# Altium project panneau_de_controle_d'acces_pcb.PrjPcb
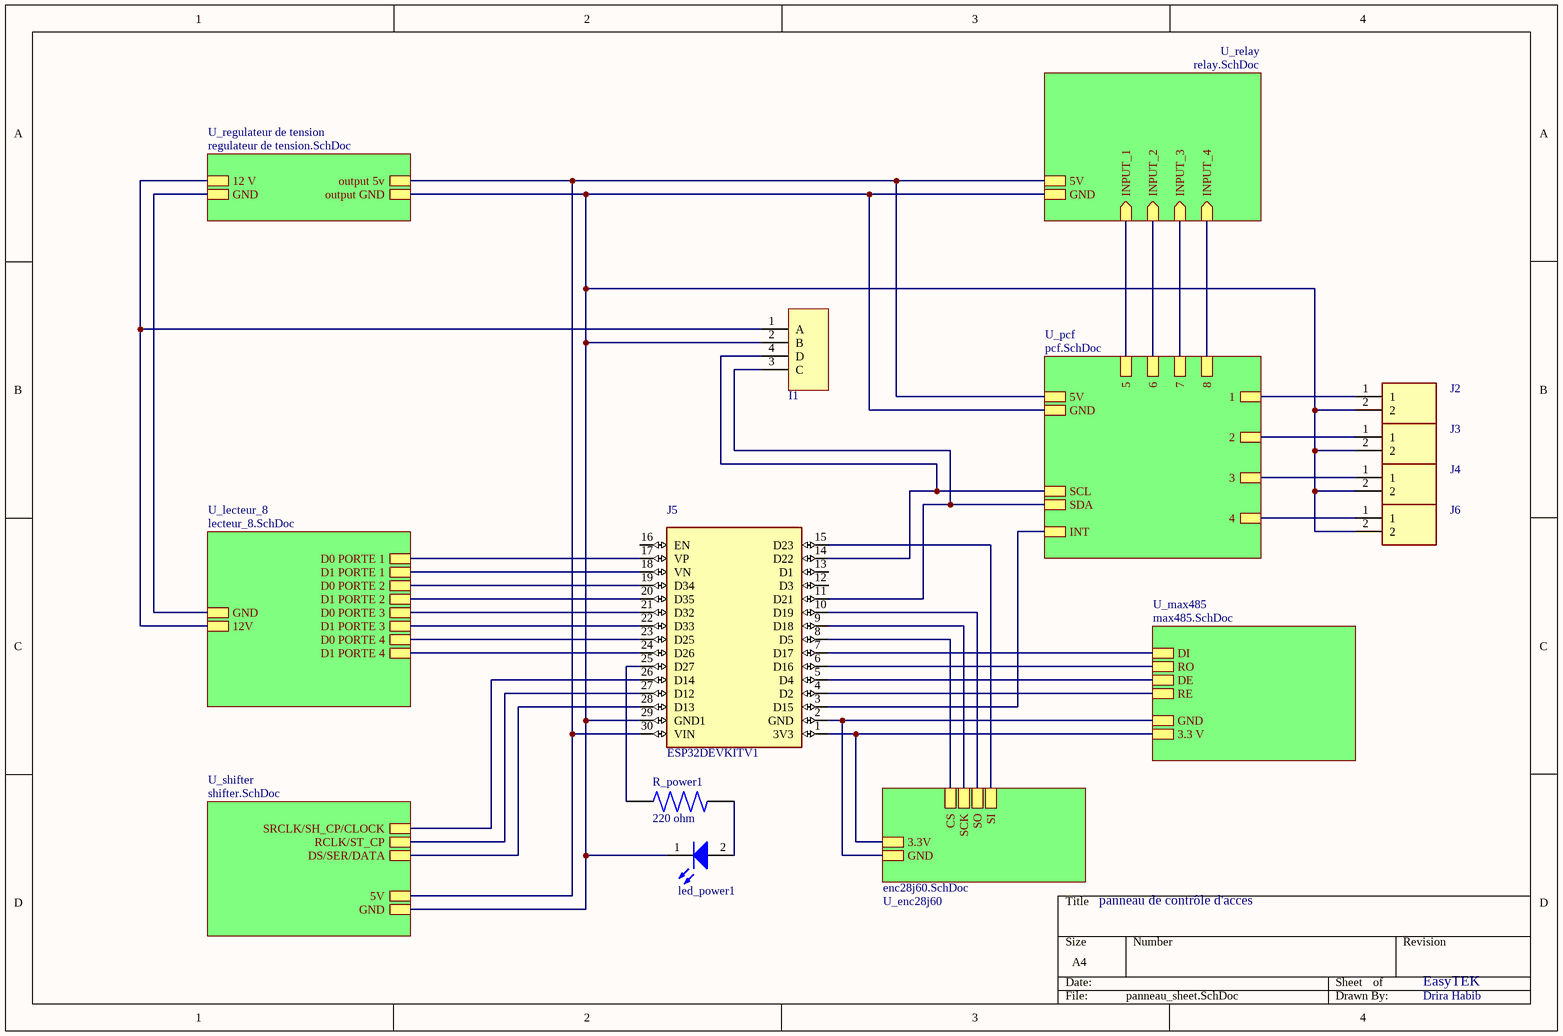
[diagram p0: panneau_sheet.SchDoc]
8 sheets, 79 parts. Net scope: hierarchical (ports join the sheet entries above them; power ports are global).
Board file: panneaucontrol_pcb.PcbDoc
Sheets:
  panneau_sheet.SchDoc
    U_enc28j60 = enc28j60.SchDoc
    U_lecteur_8 = lecteur_8.SchDoc
    U_regulateur de tension = regulateur de tension.SchDoc
    U_max485 = max485.SchDoc
    U_pcf = pcf.SchDoc
    U_relay = relay.SchDoc
    U_shifter = shifter.SchDoc

## Sheet panneau_sheet.SchDoc
size A4

### Parts
I1  Header 4  [JST_4_PIN]  (value not drawn)
J2  1546215-2  [15462152]  (value not drawn)
J3  1546215-2  [15462152]  (value not drawn)
J4  1546215-2  [15462152]  (value not drawn)
J5  ESP32DEVKITV1  [ESP32-DEVKITV1_3D]
J6  1546215-2  [15462152]  (value not drawn)
led_power1  Infrared, 1.5V, 35°  [WL-TIRW_D5.8H8.6]  (value not drawn)
R_power1  value 220 ohm  [RES_ERA2APB221X]  (hidden comment: ERA2APB221X)

### Sub-sheets
U_enc28j60 = enc28j60.SchDoc: 3.3V, CS, SI, GND, SCK, SO
U_lecteur_8 = lecteur_8.SchDoc: D1 PORTE 1, D0 PORTE 1, GND, 12V, D1 PORTE 2, D0 PORTE 2, D1 PORTE 3, D0 PORTE 3, D1 PORTE 4, D0 PORTE 4
U_max485 = max485.SchDoc: DI, DE, RE, RO, 3.3 V, GND
U_pcf = pcf.SchDoc: INT, SDA, GND, SCL, 5V, 1, 2, 3, 4, 5, 6, 7, 8
U_regulateur de tension = regulateur de tension.SchDoc: output 5v, output GND, 12 V, GND
U_relay = relay.SchDoc: INPUT_4 (in), INPUT_3 (in), INPUT_2 (in), GND, INPUT_1 (in), 5V
U_shifter = shifter.SchDoc: SRCLK/SH_CP/CLOCK, DS/SER/DATA, RCLK/ST_CP, GND, 5V

### Nets
5v: J5.30(VIN) ; sheet U_regulateur de tension/output 5v, sheet U_pcf/5V, sheet U_relay/5V, sheet U_shifter/5V
+12: I1.1(A) ; sheet U_lecteur_8/12V, sheet U_regulateur de tension/12 V
GND_1: I1.2(B) J2.2 J3.2 J4.2 J5.29(GND1) J6.2 led_power1.1(K) ; sheet U_lecteur_8/GND, sheet U_regulateur de tension/output GND, sheet U_regulateur de tension/GND, sheet U_pcf/GND, sheet U_relay/GND, sheet U_shifter/GND
NetD2_1: sheet U_pcf/5, sheet U_relay/INPUT_1
NetD3_1: sheet U_pcf/6, sheet U_relay/INPUT_2
NetD4_1: sheet U_pcf/7, sheet U_relay/INPUT_3
NetD5_1: sheet U_pcf/8, sheet U_relay/INPUT_4
NetENC1_3: J5.10(D19) ; sheet U_enc28j60/SO
NetENC1_5: J5.9(D18) ; sheet U_enc28j60/SCK
NetENC1_6: J5.15(D23) ; sheet U_enc28j60/SI
NetENC1_8: J5.8(D5) ; sheet U_enc28j60/CS
NetENC1_9: J5.2(GND) ; sheet U_enc28j60/GND, sheet U_max485/GND
NetENC1_10: J5.1(3V3) ; sheet U_enc28j60/3.3V, sheet U_max485/3.3 V
NetI1_3: I1.3(C) J5.11(D21) ; sheet U_pcf/SDA
NetI1_4: I1.4(D) J5.14(D22) ; sheet U_pcf/SCL
NetJ2_1: J2.1 ; sheet U_pcf/1
NetJ3_1: J3.1 ; sheet U_pcf/2
NetJ4_1: J4.1 ; sheet U_pcf/3
NetJ5_3: J5.3(D15) ; sheet U_pcf/INT
NetJ5_4: J5.4(D2) ; sheet U_max485/RE
NetJ5_5: J5.5(D4) ; sheet U_max485/DE
NetJ5_6: J5.6(D16) ; sheet U_max485/RO
NetJ5_7: J5.7(D17) ; sheet U_max485/DI
NetJ5_17: J5.17(VP) ; sheet U_lecteur_8/D0 PORTE 1
NetJ5_18: J5.18(VN) ; sheet U_lecteur_8/D1 PORTE 1
NetJ5_19: J5.19(D34) ; sheet U_lecteur_8/D0 PORTE 2
NetJ5_20: J5.20(D35) ; sheet U_lecteur_8/D1 PORTE 2
NetJ5_21: J5.21(D32) ; sheet U_lecteur_8/D0 PORTE 3
NetJ5_22: J5.22(D33) ; sheet U_lecteur_8/D1 PORTE 3
NetJ5_23: J5.23(D25) ; sheet U_lecteur_8/D0 PORTE 4
NetJ5_24: J5.24(D26) ; sheet U_lecteur_8/D1 PORTE 4
NetJ5_25: J5.25(D27) R_power1.1
NetJ5_26: J5.26(D14) ; sheet U_shifter/SRCLK/SH_CP/CLOCK
NetJ5_27: J5.27(D12) ; sheet U_shifter/RCLK/ST_CP
NetJ5_28: J5.28(D13) ; sheet U_shifter/DS/SER/DATA
NetJ6_1: J6.1 ; sheet U_pcf/4
Netled_power1_2: led_power1.2(A) R_power1.2

Not connected (* = marked no-connect by the designer): J5 12(D3) 13(D1) 16(EN)

### Notes on the sheet
- panneau de contrôle d'acces
- EasyTEK
- Drira Habib

### Library data of the parts
I1 = Connector_4Pin
J2-J4 J6 = 1546215-2: Connector; Manufacturer_Name: TE Connectivity; Datasheet Link: https://www.te.com/commerce/DocumentDelivery/DDEController?Action=srchrtrv&DocNm=1546215&DocType=Customer+Drawing&DocLang=English; Height: 10.3mm; Manufacturer_Part_Number: 1546215-2; Mouser Part Number: 571-1546215-2; Mouser Price/Stock: https://www.mouser.co.uk/ProductDetail/TE-Connectivity/1546215-2?qs=Lxq28tKK6BPmJFoAOY7Ljw%3D%3D; Arrow Part Number: 1546215-2; Arrow Price/Stock: https://www.arrow.com/en/products/1546215-2/te-connectivity?region=nac
J5 = ESP32DEVKITV1: Dual core, Wi-Fi: 2.4 GHz up to 150 Mbits/s,BLE (Bluetooth Low Energy) and legacy Bluetooth, 32 bits, Up to 240 MHz; MF: Do it; Check_prices: https://www.snapeda.com/parts/ESP32%20DEVKIT%20V1/Do%20it/view-part/5659245/?ref=eda; Value: *; SnapEDA_Link: https://www.snapeda.com/parts/ESP32%20DEVKIT%20V1/Do%20it/view-part/5659245/?ref=snap; Package: Package; Availability: Unavailable; Price: None; MP: ESP32 DEVKIT V1
led_power1 = 15400585A3590: WL-TIRW THT Infrared Round Waterclear, D5.8 x H8.6mm, 85mW/sr, Infrared, 1.5V, 35°; Manufacturer: Wurth Elektronik; Centroid Wavelength: 845nm; Chip Technology: AlGaAs; Peak Wavelength: 850nm; Manufacturer Part Number: 15400585A3590; Category: Infrared LEDs; Match Code: WL-TIRW; ComponentLink1Description: Website Link; ComponentLink1URL: https://www.we-online.com/redexpert/article/15400585A3590?ad; ComponentLink2Description: Datasheet Link; ComponentLink2URL: https://www.we-online.com/redexpert/spec/15400585A3590?ad; Mount: Through Hole; Operating Temperature Max: 85°C; Operating Temperature Min: -40°C; Packaging: Bulk; Height: 8.6mm; Diameter: 5.8mm; Emitting Color: Infrared; Forward Voltage: 1.5V; Radiant Intensity: 85mW/sr; Viewing Angle: 35°
R_power1 = ERA2APB221X: Availability: Unavailable; MP: ERA2APB221X; Price: None; Package: None

## Sheet enc28j60.SchDoc
size A4
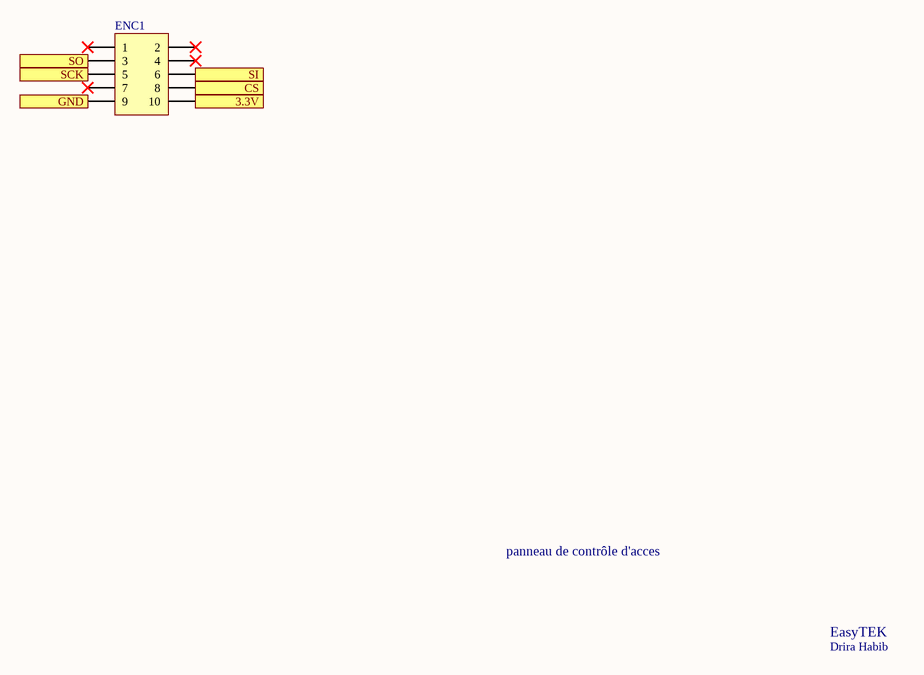
[diagram p1: enc28j60.SchDoc]

### Parts
ENC1  Header 5X2  [HDR2X5]  (value not drawn)

### Ports
3.3V, CS, GND, SCK, SI, SO

### Nets
NetENC1_3: ENC1.3 ; port SO
NetENC1_5: ENC1.5 ; port SCK
NetENC1_6: ENC1.6 ; port SI
NetENC1_8: ENC1.8 ; port CS
NetENC1_9: ENC1.9 ; port GND
NetENC1_10: ENC1.10 ; port 3.3V

Not connected (* = marked no-connect by the designer): ENC1 1* 2* 4* 7*

### Notes on the sheet
- panneau de contrôle d'acces
- EasyTEK
- Drira Habib

### Library data of the parts
ENC1 = Header 5X2: Header, 5-Pin, Dual row; LatestRevisionDate: 17-Jul-2002; LatestRevisionNote: Re-released for DXP Platform.; Publisher: Altium Limited

## Sheet lecteur_8.SchDoc
size A4
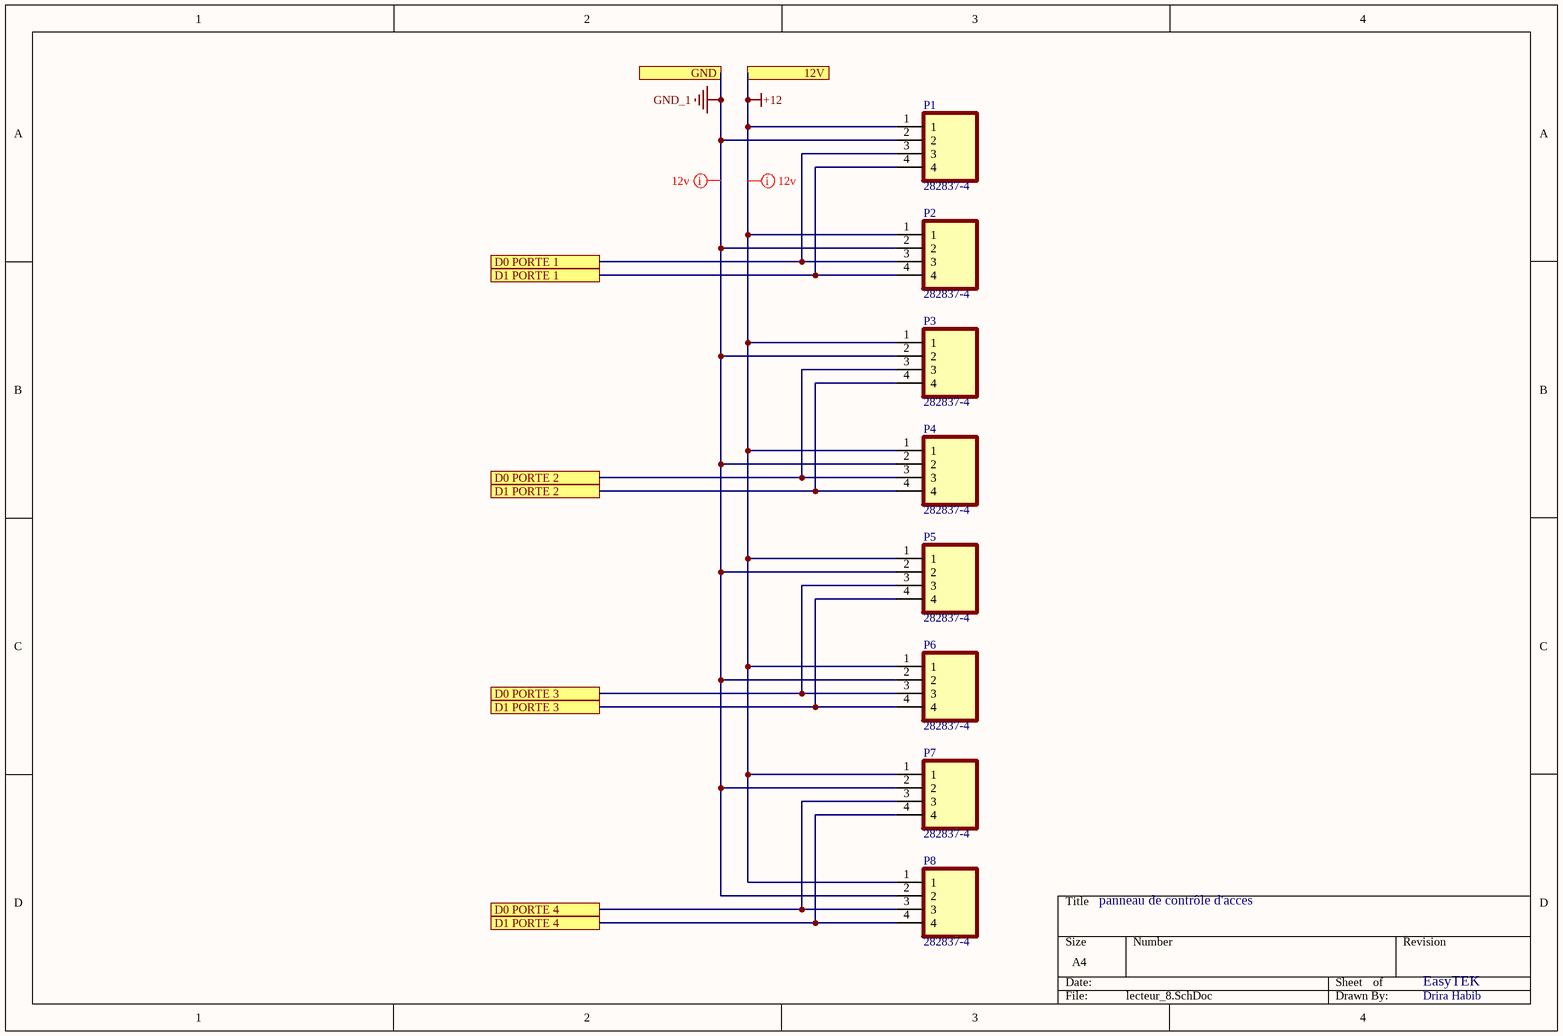
[diagram p2: lecteur_8.SchDoc]

### Parts
P1  282837-4  [TE_282837-4]
P2  282837-4  [TE_282837-4]
P3  282837-4  [TE_282837-4]
P4  282837-4  [TE_282837-4]
P5  282837-4  [TE_282837-4]
P6  282837-4  [TE_282837-4]
P7  282837-4  [TE_282837-4]
P8  282837-4  [TE_282837-4]

### Ports
12V, D0 PORTE 1, D0 PORTE 2, D0 PORTE 3, D0 PORTE 4, D1 PORTE 1, D1 PORTE 2, D1 PORTE 3, D1 PORTE 4, GND

### Nets
+12: P1.1 P2.1 P3.1 P4.1 P5.1 P6.1 P7.1 P8.1 ; port 12V
GND_1: P1.2 P2.2 P3.2 P4.2 P5.2 P6.2 P7.2 P8.2 ; port GND
NetJ5_17: P1.3 P2.3 ; port D0 PORTE 1
NetJ5_18: P1.4 P2.4 ; port D1 PORTE 1
NetJ5_19: P3.3 P4.3 ; port D0 PORTE 2
NetJ5_20: P3.4 P4.4 ; port D1 PORTE 2
NetJ5_21: P5.3 P6.3 ; port D0 PORTE 3
NetJ5_22: P5.4 P6.4 ; port D1 PORTE 3
NetJ5_23: P7.3 P8.3 ; port D0 PORTE 4
NetJ5_24: P7.4 P8.4 ; port D1 PORTE 4

### Layout directives
net class 12: +12, GND_1

### Notes on the sheet
- panneau de contrôle d'acces
- EasyTEK
- Drira Habib

### Library data of the parts
P1-P8 = 282837-4: 4 Position Wire to Board Terminal Block Horizontal with Board 0.200 (5.08mm) Through Hole; MF: TE Connectivity; Value: *; SnapEDA_Link: https://www.snapeda.com/parts/282837-4/TE+Connectivity+AMP+Connectors/view-part/?ref=snap; Purchase-URL: https://pricing.snapeda.com/search/part/282837-4/?ref=eda; EU_RoHS_Compliance: Compliant with Exemptions; Availability: In Stock; Price: None; Package: None; Check_prices: https://www.snapeda.com/parts/282837-4/TE+Connectivity+AMP+Connectors/view-part/?ref=eda; MP: 282837-4

## Sheet regulateur de tension.SchDoc
size A4
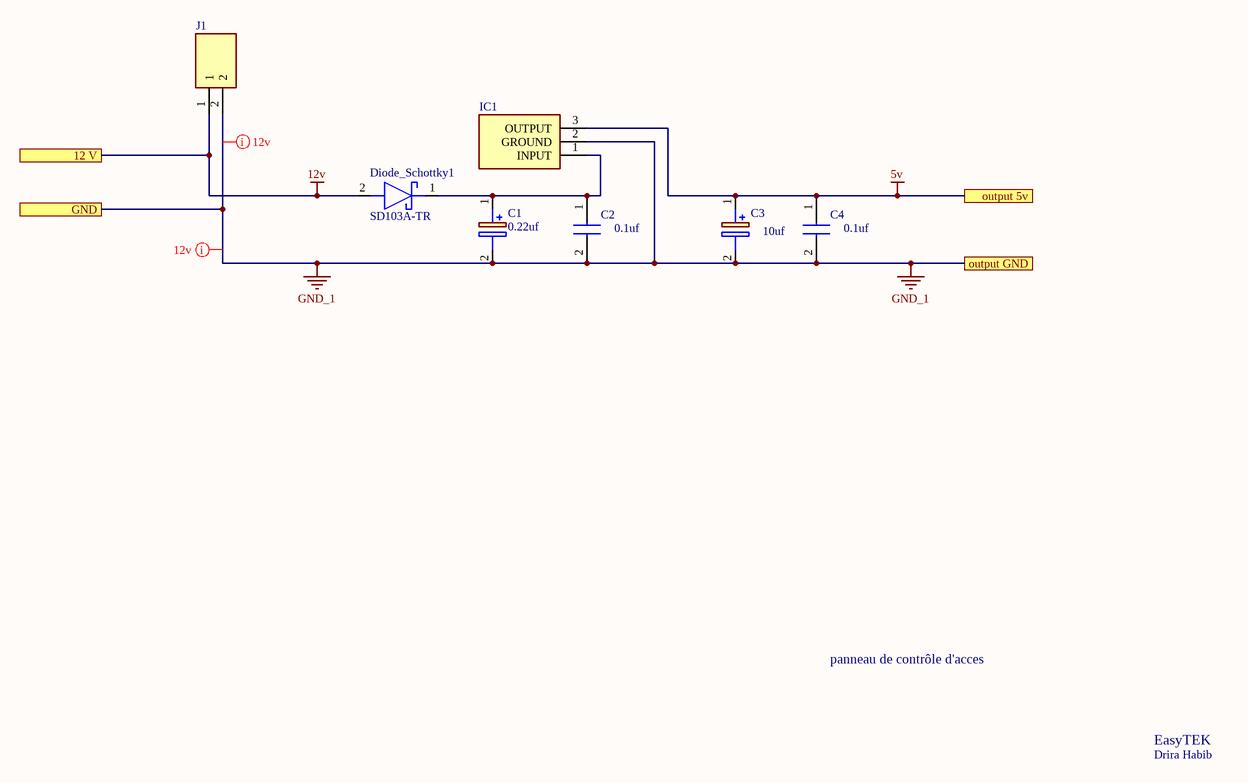
[diagram p3: regulateur de tension.SchDoc]

### Parts
C1  0.22uf  [CAPPRD200W52D500H1250]
C2  0.1uf  [RDE5C1H330J0M1H03A]
C3  10uf  [CAPPRD200W55D500H1250]
C4  0.1uf  [RDE5C1H330J0M1H03A]
Diode_Schottky1  SD103A-TR  [DIOAD950W60L350D150]
IC1  L7805CV  [TO255P460X1020X2008-3P]  (value not drawn)
J1  1546215-2  [15462152]  (value not drawn)

### Ports
12 V, GND, output 5v, output GND

### Nets
5v: C3.1(+) C4.1 IC1.3(OUTPUT) ; port output 5v
12v: Diode_Schottky1.2(A) J1.1 ; port 12 V  [project net +12]
GND_1: C1.2(-) C2.2 C3.2(-) C4.2 IC1.2(GROUND) J1.2 ; port output GND, port GND
NetC1_1: C1.1(+) C2.1 Diode_Schottky1.1(K) IC1.1(INPUT)

### Layout directives
net class 12; net class *: GND_1
net class 12: GND_1

### Notes on the sheet
- panneau de contrôle d'acces
- EasyTEK
- Drira Habib

### Library data of the parts
C1 = 860010772002: Capacitor Polarised; Manufacturer_Name: Wurth Elektronik; Datasheet Link: https://componentsearchengine.com/Datasheets/1/860010772002.pdf; Height: 12.5mm; Manufacturer_Part_Number: 860010772002; Mouser Part Number: 710-860010772002; Mouser Price/Stock: https://www.mouser.co.uk/ProductDetail/Wurth-Elektronik/860010772002?qs=0KOYDY2FL2%2FXueoM4QQtRg%3D%3D
C2 C4 = RDER71E104K0K1H03B: Capacitor; Manufacturer_Name: Murata Electronics; Datasheet Link: https://psearch.en.murata.com/capacitor/product/RDER71E104K0K1H03B.html; Height: 5mm; Manufacturer_Part_Number: RDER71E104K0K1H03B; Mouser Part Number: 81-RDER71E104K0K1H3B; Mouser Price/Stock: https://www.mouser.co.uk/ProductDetail/Murata-Electronics/RDER71E104K0K1H03B?qs=hNud%2FORuBR18qWStUKZMCw%3D%3D; Arrow Part Number: RDER71E104K0K1H03B; Arrow Price/Stock: https://www.arrow.com/en/products/rder71e104k0k1h03b/murata-manufacturing?region=nac
C3 = EEUFR1H100: Capacitor Polarised; Manufacturer_Name: Panasonic; Datasheet Link: http://industrial.panasonic.com/cdbs/www-data/pdf/RDF0000/ABA0000C1259.pdf; Height: 12.5mm; Manufacturer_Part_Number: EEUFR1H100; Arrow Part Number: EEUFR1H100; Arrow Price/Stock: https://www.arrow.com/en/products/eeufr1h100/panasonic?region=nac
Diode_Schottky1 = SD103A-TR: Schottky Diode; Manufacturer_Name: Vishay; Datasheet Link: https://componentsearchengine.com/Datasheets/5/SD103A-TR.pdf; Manufacturer_Part_Number: SD103A-TR; Mouser Part Number: 625-SD103A; Mouser Price/Stock: https://www.mouser.co.uk/ProductDetail/Vishay-Semiconductors/SD103A-TR?qs=RwahMLkpD2urFD%2FzZdGOBw%3D%3D; Arrow Part Number: SD103A-TR; Arrow Price/Stock: https://www.arrow.com/en/products/sd103a-tr/vishay?region=nac
IC1 = L7805CV: Integrated Circuit; Manufacturer_Name: STMicroelectronics; Datasheet Link: http://www.st.com/web/en/resource/technical/document/datasheet/CD00000444.pdf; Height: 4.6mm; Manufacturer_Part_Number: L7805CV; Mouser Part Number: 511-L7805CV; Mouser Price/Stock: https://www.mouser.co.uk/ProductDetail/STMicroelectronics/L7805CV?qs=9NrABl3fj%2FqplZAHiYUxWg%3D%3D; Arrow Part Number: L7805CV; Arrow Price/Stock: https://www.arrow.com/en/products/l7805cv/stmicroelectronics?region=europe
J1 = 1546215-2: as J2 on sheet panneau_sheet; Datasheet Link: https://www.te.com/commerce/DocumentDelivery/DDEController?Action=srchrtrv&DocNm=1546215&DocType=Customer+Drawing&DocLang=English; Height: 10.3mm; Manufacturer_Part_Number: 1546215-2; Mouser Part Number: 571-1546215-2; Mouser Price/Stock: https://www.mouser.co.uk/ProductDetail/TE-Connectivity/1546215-2?qs=Lxq28tKK6BPmJFoAOY7Ljw%3D%3D; Arrow Part Number: 1546215-2; Arrow Price/Stock: https://www.arrow.com/en/products/1546215-2/te-connectivity?region=nac

## Sheet max485.SchDoc
size A4
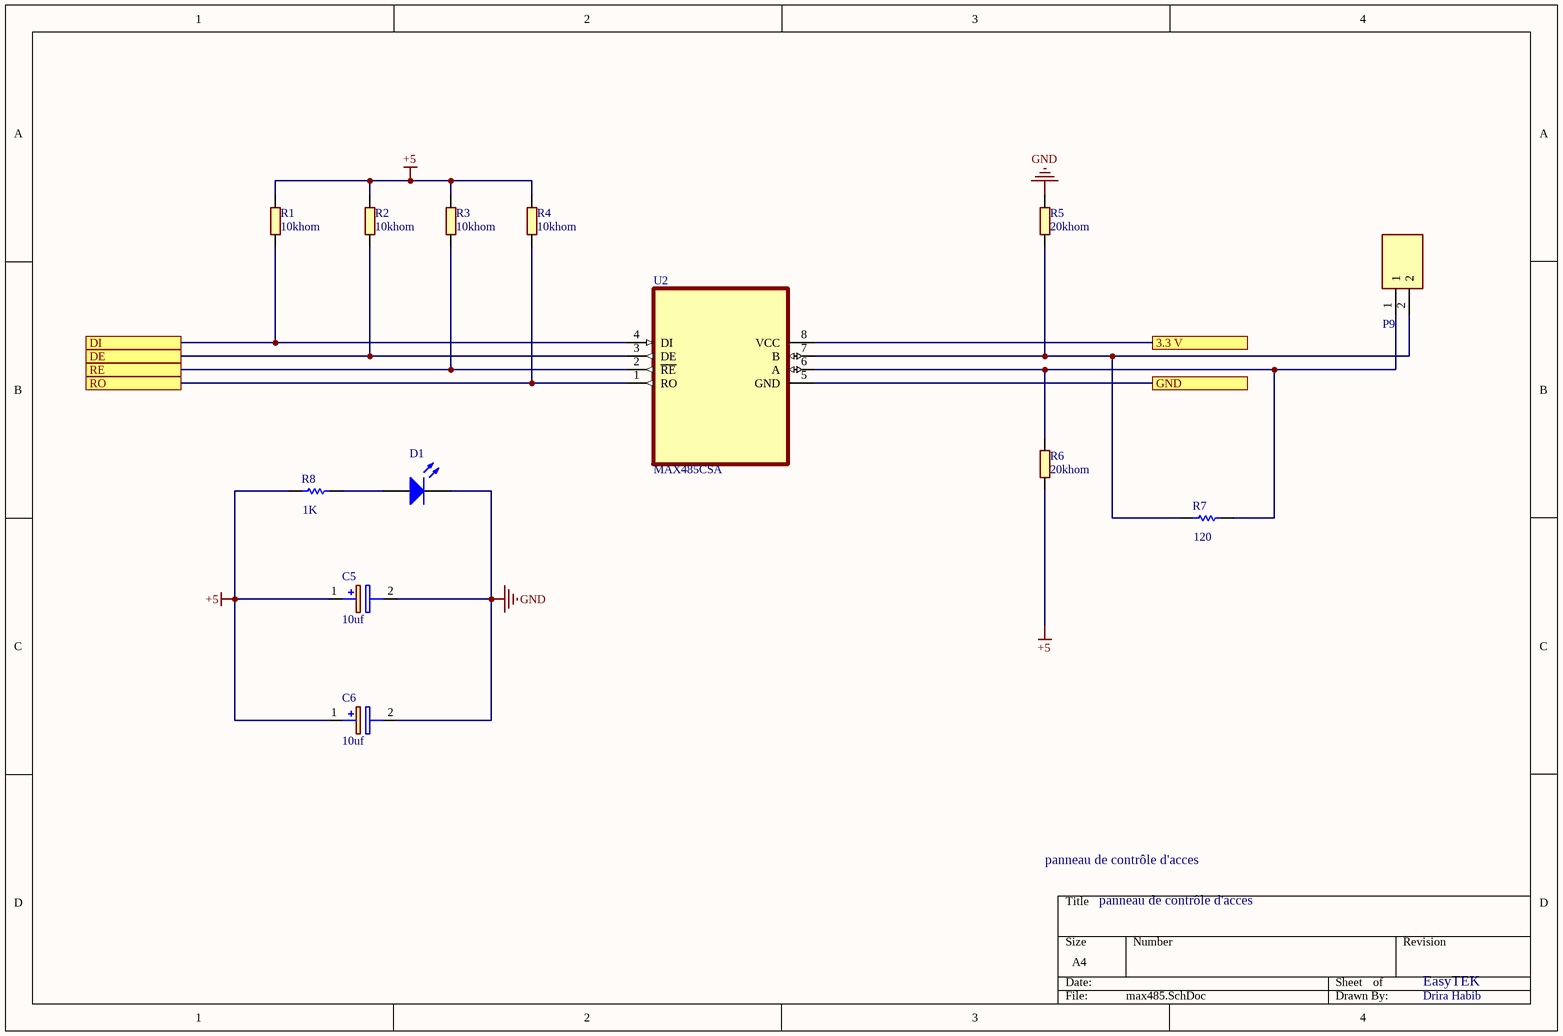
[diagram p4: max485.SchDoc]

### Parts
C5  10uf  [CAPPRD200W55D500H1250]
C6  10uf  [CAPPRD200W55D500H1250]
D1  LED_SMD  [0603_LED]  (value not drawn)
P9  1546215-2  [15462152]  (value not drawn)
R1  10khom  [0603]
R2  10khom  [0603]
R3  10khom  [0603]
R4  10khom  [0603]
R5  20khom  [0603]
R6  20khom  [0603]
R7  value 120  [R0603]  (hidden comment: Res1)
R8  value 1K  [R0603]  (hidden comment: Res1)
U2  MAX485CSA  [SOIC127P600X175-8N]

### Ports
3.3 V, DE, DI, GND, RE, RO

### Nets
+5: C5.1(+) C6.1(+) R1.1 R2.1 R3.1 R4.1 R6.1 R8.1
GND: C5.2(-) C6.2(-) D1.2(K) R5.2
NetD1_1: D1.1(A) R8.2
NetENC1_9: U2.5(GND) ; port GND
NetENC1_10: U2.8(VCC) ; port 3.3 V
NetJ5_4: R3.2 U2.2(~{RE}) ; port RE
NetJ5_5: R2.2 U2.3(DE) ; port DE
NetJ5_6: R4.2 U2.1(RO) ; port RO
NetJ5_7: R1.2 U2.4(DI) ; port DI
NetP9_1: P9.1 R6.2 R7.2 U2.6(A)
NetP9_2: P9.2 R5.1 R7.1 U2.7(B)

### Notes on the sheet
- panneau de contrôle d'acces
- EasyTEK
- Drira Habib

### Library data of the parts
C5 C6 = EEUFR1H100: as C3 on sheet regulateur de tension; Datasheet Link: http://industrial.panasonic.com/cdbs/www-data/pdf/RDF0000/ABA0000C1259.pdf; Height: 12.5mm; Manufacturer_Part_Number: EEUFR1H100; Arrow Part Number: EEUFR1H100; Arrow Price/Stock: https://www.arrow.com/en/products/eeufr1h100/panasonic?region=nac
D1 = LED_SMD: LED RED CLEAR 0603 SMD; Manufacturer Part Number: LTST-C191KRKT; PackageReference: 0603 (1608 Metric); PackageDescription: 1.60mm L x 0.80mm W; Digikey Part Number: 160-1447-1-ND; Value: RED
P9 = 1546215-2: as J2 on sheet panneau_sheet; Datasheet Link: https://www.te.com/commerce/DocumentDelivery/DDEController?Action=srchrtrv&DocNm=1546215&DocType=Customer+Drawing&DocLang=English; Height: 10.3mm; Manufacturer_Part_Number: 1546215-2; Mouser Part Number: 571-1546215-2; Mouser Price/Stock: https://www.mouser.co.uk/ProductDetail/TE-Connectivity/1546215-2?qs=Lxq28tKK6BPmJFoAOY7Ljw%3D%3D; Arrow Part Number: 1546215-2; Arrow Price/Stock: https://www.arrow.com/en/products/1546215-2/te-connectivity?region=nac
R1-R6 = RC0603JR-0710KA: RESISTOR, THICK FILM, 10KOHM, 100mW, 5%; MF: Yageo; Availability: Unavailable; Package: 0603 Yageo; Price: None; SnapEDA_Link: https://www.snapeda.com/parts/RC0603JR-0710KA/Yageo/view-part/947164/?ref=snap; MP: RC0603JR-0710KA
  R1-R4: Value: *
  R5 R6: Value: 20Khom
R7 R8 = Res1: Resistor; PackageReference: AXIAL-0.3; PackageDescription: Axial Device, Thru-Hole; 2 Leads; 0.3 in Pin Spacing
U2 = MAX485CSA: Package: None; Value: *; Price: None; MP: MAX485CSA; Availability: Unavailable

## Sheet pcf.SchDoc
size A4
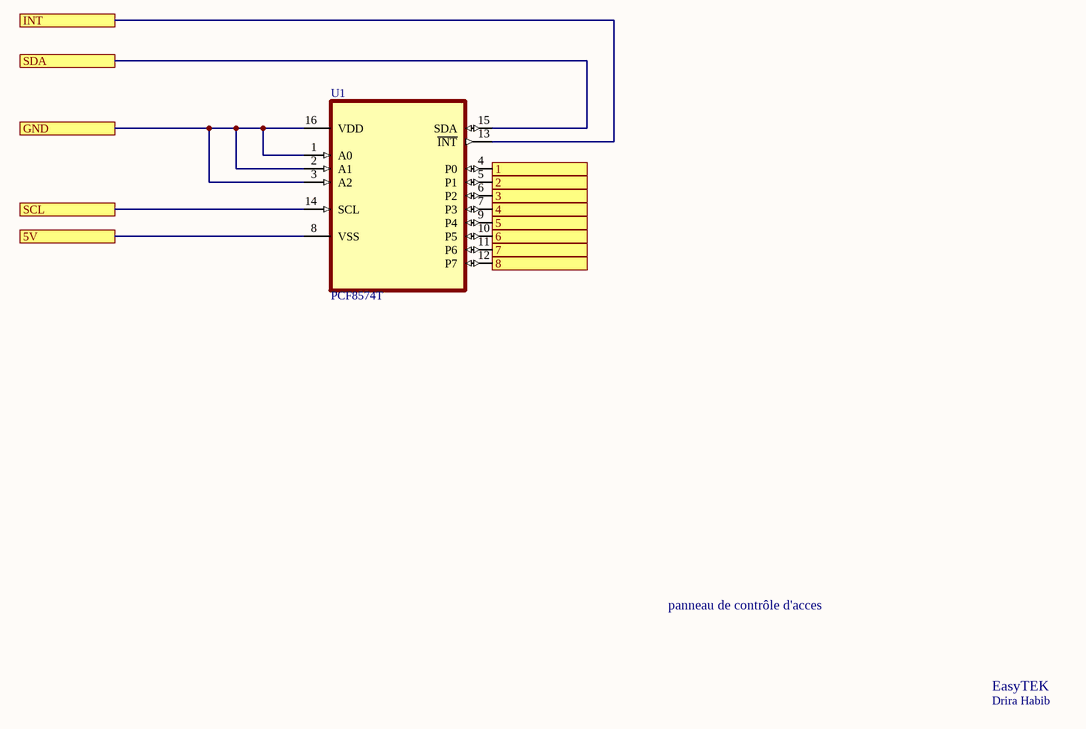
[diagram p5: pcf.SchDoc]

### Parts
U1  PCF8574T  [SOIC127P1032X265-16N]

### Ports
1, 2, 3, 4, 5, 5V, 6, 7, 8, GND, INT, SCL, SDA

### Nets
5v: U1.8(VSS) ; port 5V
GND_1: U1.1(A0) U1.2(A1) U1.3(A2) U1.16(VDD) ; port GND
NetD2_1: U1.9(P4) ; port 5
NetD3_1: U1.10(P5) ; port 6
NetD4_1: U1.11(P6) ; port 7
NetD5_1: U1.12(P7) ; port 8
NetI1_3: U1.15(SDA) ; port SDA
NetI1_4: U1.14(SCL) ; port SCL
NetJ2_1: U1.4(P0) ; port 1
NetJ3_1: U1.5(P1) ; port 2
NetJ4_1: U1.6(P2) ; port 3
NetJ5_3: U1.13(~{INT}) ; port INT
NetJ6_1: U1.7(P3) ; port 4

### Notes on the sheet
- panneau de contrôle d'acces
- EasyTEK
- Drira Habib

### Library data of the parts
U1 = PCF8574T: I/O Expander 8 IÂ²C 100 kHz 20-SSOP; MF: NXP Semiconductors; MP: PCF8574T; Price: None; Availability: In Stock; Package: SOIC-16 NXP Semiconductors; Purchase-URL: https://pricing.snapeda.com/search/part/PCF8574T/?ref=eda; SnapEDA_Link: https://www.snapeda.com/parts/PCF8574T/NXP+Semiconductors/view-part/?ref=snap; Value: *; Check_prices: https://www.snapeda.com/parts/PCF8574T/NXP+Semiconductors/view-part/?ref=eda

## Sheet relay.SchDoc
size A4
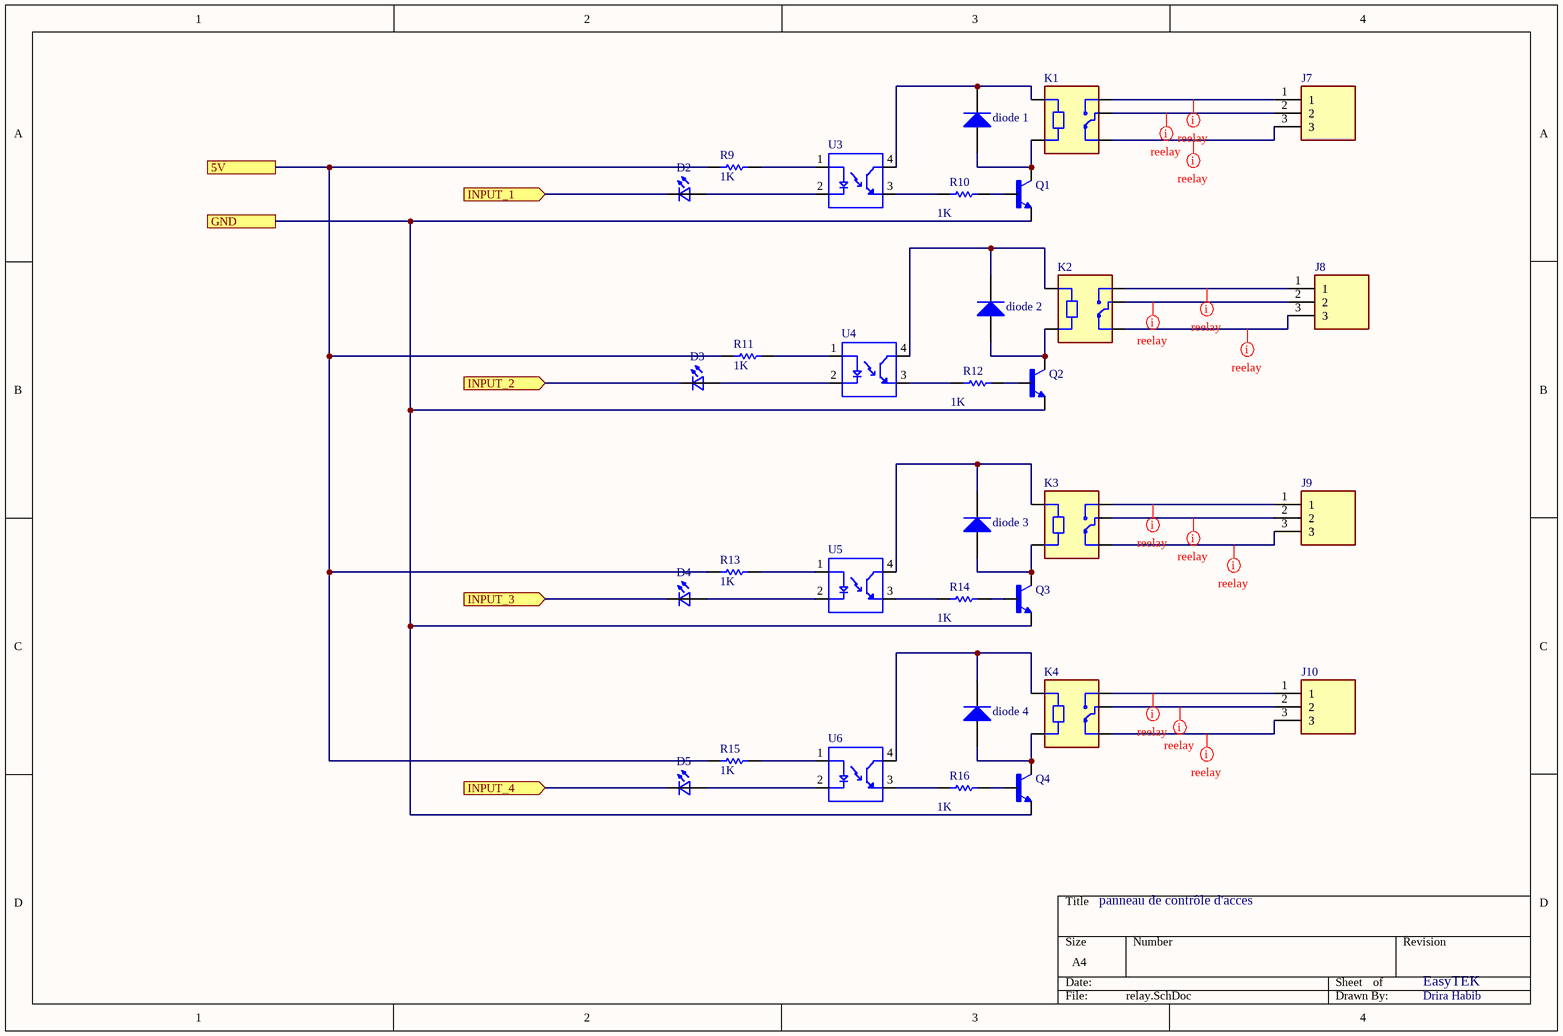
[diagram p6: relay.SchDoc]

### Parts
D2  LTST-C193TBKT-5A  [0603 - duplicate]  (value not drawn)
D3  LTST-C193TBKT-5A  [0603 - duplicate]  (value not drawn)
D4  LTST-C193TBKT-5A  [0603 - duplicate]  (value not drawn)
D5  LTST-C193TBKT-5A  [0603 - duplicate]  (value not drawn)
diode_1  Diode 1N4001  [DO-41]  (value not drawn)
diode_2  Diode 1N4003  [DO-41]  (value not drawn)
diode_3  Diode 1N4003  [DO-41]  (value not drawn)
diode_4  Diode 1N4003  [DO-41]  (value not drawn)
J7  TB006-508-03BE  [CUI_TB006-508-03BE]  (value not drawn)
J8  TB006-508-03BE  [CUI_TB006-508-03BE]  (value not drawn)
J9  TB006-508-03BE  [CUI_TB006-508-03BE]  (value not drawn)
J10  TB006-508-03BE  [CUI_TB006-508-03BE]  (value not drawn)
K1  SRD-05VDC-SL-C  [RELAY_SRD-05VDC-SL-C]  (value not drawn)
K2  SRD-05VDC-SL-C  [RELAY_SRD-05VDC-SL-C]  (value not drawn)
K3  SRD-05VDC-SL-C  [RELAY_SRD-05VDC-SL-C]  (value not drawn)
K4  SRD-05VDC-SL-C  [RELAY_SRD-05VDC-SL-C]  (value not drawn)
Q1  BCW31*  [SOT23-BEC]  (value not drawn)
Q2  BCW31*  [SOT23-BEC]  (value not drawn)
Q3  BCW31*  [SOT23-BEC]  (value not drawn)
Q4  BCW31*  [SOT23-BEC]  (value not drawn)
R9  value 1K  [R0603]  (hidden comment: Res1)
R10  value 1K  [R0603]  (hidden comment: Res1)
R11  value 1K  [R0603]  (hidden comment: Res1)
R12  value 1K  [R0603]  (hidden comment: Res1)
R13  value 1K  [R0603]  (hidden comment: Res1)
R14  value 1K  [R0603]  (hidden comment: Res1)
R15  value 1K  [R0603]  (hidden comment: Res1)
R16  value 1K  [R0603]  (hidden comment: Res1)
U3  LTV-817-A  [DIP762W50P254L510H500Q4]  (value not drawn)
U4  LTV-817-A  [DIP762W50P254L510H500Q4]  (value not drawn)
U5  LTV-817-A  [DIP762W50P254L510H500Q4]  (value not drawn)
U6  LTV-817-A  [DIP762W50P254L510H500Q4]  (value not drawn)

### Ports
5V, GND, INPUT_1 (in), INPUT_2 (in), INPUT_3 (in), INPUT_4 (in)

### Nets
5v: R9.2 R11.2 R13.2 R15.2 ; port 5V
GND_1: Q1.E Q2.E Q3.E Q4.E ; port GND
NetD2_1: D2.1(K2) ; port INPUT_1
NetD2_2: D2.2(A2) U3.2(C)
NetD3_1: D3.1(K2) ; port INPUT_2
NetD3_2: D3.2(A2) U4.2(C)
NetD4_1: D4.1(K2) ; port INPUT_3
NetD4_2: D4.2(A2) U5.2(C)
NetD5_1: D5.1(K2) ; port INPUT_4
NetD5_2: D5.2(A2) U6.2(C)
Netdiode_1_1: diode_1.1(A) K1.A2 Q1.C
Netdiode_1_2: diode_1.2(K) K1.A1 U3.4(CT)
Netdiode_2_1: diode_2.1(A) K2.A2 Q2.C
Netdiode_2_2: diode_2.2(K) K2.A1 U4.4(CT)
Netdiode_3_1: diode_3.1(A) K3.A2 Q3.C
Netdiode_3_2: diode_3.2(K) K3.A1 U5.4(CT)
Netdiode_4_1: diode_4.1(A) K4.A2 Q4.C
Netdiode_4_2: diode_4.2(K) K4.A1 U6.4(CT)
NetJ7_1: J7.1 K1.NO
NetJ7_2: J7.2 K1.COM
NetJ7_3: J7.3 K1.NC
NetJ8_1: J8.1 K2.NO
NetJ8_2: J8.2 K2.COM
NetJ8_3: J8.3 K2.NC
NetJ9_1: J9.1 K3.NO
NetJ9_2: J9.2 K3.COM
NetJ9_3: J9.3 K3.NC
NetJ10_1: J10.1 K4.NO
NetJ10_2: J10.2 K4.COM
NetJ10_3: J10.3 K4.NC
NetQ1_B: Q1.B R10.2
NetQ2_B: Q2.B R12.2
NetQ3_B: Q3.B R14.2
NetQ4_B: Q4.B R16.2
NetR9_1: R9.1 U3.1(A)
NetR10_1: R10.1 U3.3(ET)
NetR11_1: R11.1 U4.1(A)
NetR12_1: R12.1 U4.3(ET)
NetR13_1: R13.1 U5.1(A)
NetR14_1: R14.1 U5.3(ET)
NetR15_1: R15.1 U6.1(A)
NetR16_1: R16.1 U6.3(ET)

### Layout directives
net class realy: NetJ7_1, NetJ7_2, NetJ7_3, NetJ8_1, NetJ8_2, NetJ8_3, NetJ9_1, NetJ9_2, NetJ9_3, NetJ10_1, NetJ10_2, NetJ10_3

### Notes on the sheet
- panneau de contrôle d'acces
- EasyTEK
- Drira Habib

### Library data of the parts
D2-D5 = LTST-C193TBKT-5A: Blue 470nm LED Indication - Discrete 2.8V 0603 _1608 Metric_; MF: Lite-On Inc.; MP: LTST-C193TBKT-5A; Value: *; Digi-Key_Purchase_URL: https://www.digikey.com/product-detail/en/lite-on-inc/LTST-C193TBKT-5A/160-1827-1-ND/2355044?utm_source=snapeda&utm_medium=aggregator&utm_campaign=symbol; SnapEDA_Link: https://www.snapeda.com/parts/LTST-C193TBKT-5A/Lite-On%20Inc./view-part/350303/?ref=snap; Digi-Key_Part_Number: 160-1827-1-ND; Package: 0603 Lite-On
diode_1 = Diode 1N4001: 1 Amp General Purpose Rectifier; PackageReference: DO-41; PackageDescription: Diode, Axial; Body 5.2 x 2.7 mm (LxDia. max), Lead Dia. 0.86 mm (max); Published: 8-Jun-2000; LatestRevisionDate: 17-Jul-2002; LatestRevisionNote: Re-released for DXP Platform.; DatasheetVersion: 1998; PackageVersion: Aug-1999; Publisher: Altium Limited; Code_JEDEC: DO-204-AL; ComponentLink1Description: Manufacturer Link; ComponentLink1URL: http://www.fairchildsemi.com/; ComponentLink2Description: Datasheet; ComponentLink2URL: http://www.fairchildsemi.com/ds/1N%2F1N4001.pdf
diode_2-diode_4 = Diode 1N4003: 1 Amp General Purpose Rectifier; PackageReference: DO-41; PackageDescription: Diode, Axial; Body 5.2 x 2.7 mm (LxDia. max), Lead Dia. 0.86 mm (max)
J7-J10 = TB006-508-03BE: 2~24 Poles, Screw Type, Horizontal, 5.08 Pitch, 26~14 (AWG), Terminal Block Connector; MF: CUI Devices; Price: None; CUI_purchase_URL: https://www.cuidevices.com/product/interconnect/connectors/terminal-blocks/tb006-508-series?utm_source=snapeda.com&utm_medium=referral&utm_campaign=snapedaBOM; Purchase-URL: https://pricing.snapeda.com/search/part/TB006-508-03BE/?ref=eda; MP: TB006-508-03BE; Value: *; Package: None; SnapEDA_Link: https://www.snapeda.com/parts/TB006-508-03BE/CUI+Devices/view-part/?ref=snap; Availability: In Stock; Check_prices: https://www.snapeda.com/parts/TB006-508-03BE/CUI+Devices/view-part/?ref=eda
K1-K4 = SRD-05VDC-SL-C: 5V Trigger Relay Module For Arduino And Raspberry Pi 5V Trigger Relay Module For Arduino And Raspberry Pi; MF: Songle Relay; Check_prices: https://www.snapeda.com/parts/SRD-05VDC-SL-C/Songle+Relay/view-part/?ref=eda; Value: *; Availability: Not in stock; Price: None; Package: NON STANDARD-5 Songle Relay; MP: SRD-05VDC-SL-C; SnapEDA_Link: https://www.snapeda.com/parts/SRD-05VDC-SL-C/Songle+Relay/view-part/?ref=snap
Q1-Q4 = BCW31*: â€¢ This device is designed for general purpose amplifier applications at collector currents to 300 mA. â€¢ Sourced from process 10.; MF: Fairchild Semiconductor; MP: BCW31; Check_prices: https://www.snapeda.com/parts/BCW31/Fairchild+Semiconductor/view-part/?ref=eda; Purchase-URL: https://pricing.snapeda.com/search/part/BCW31/?ref=eda; Price: None; SnapEDA_Link: https://www.snapeda.com/parts/BCW31/Fairchild+Semiconductor/view-part/?ref=snap; Availability: In Stock; Package: SOT-23 ON; Value: *
R9-R16 = Res1: Resistor; PackageReference: AXIAL-0.3; PackageDescription: Axial Device, Thru-Hole; 2 Leads; 0.3 in Pin Spacing
U3-U6 = LTV-817-A: Optoisolator Transistor Output 5000Vrms 1 Channel 4-DIP; MF: Lite-On Inc.; MP: LTV-817-A; Package: DIP-4 Lite-On Inc.; Digi-Key_Part_Number: 160-2037-5-ND; SnapEDA_Link: https://www.snapeda.com/parts/LTV-817-A/Lite-On%20Inc./view-part/3215369/?ref=snap; Value: *; Digi-Key_Purchase_URL: https://www.digikey.bg/product-detail/en/lite-on-inc/LTV-817-A/160-2037-5-ND/3199509?utm_source=snapeda&utm_medium=aggregator&utm_campaign=symbol

## Sheet shifter.SchDoc
size A4
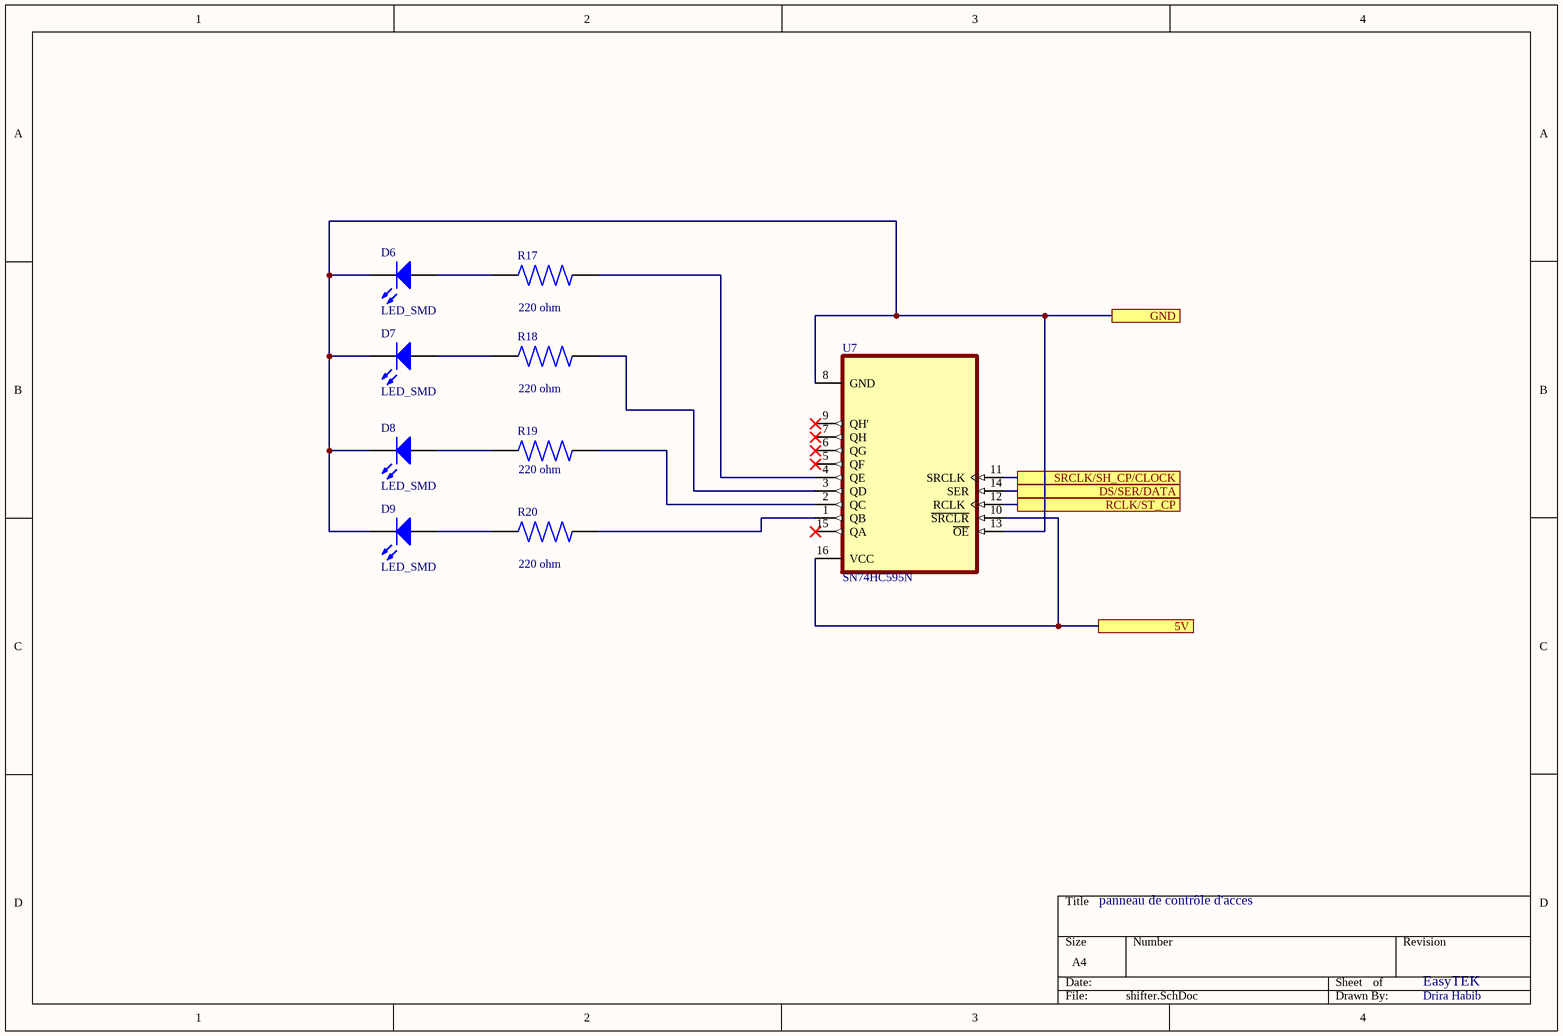
[diagram p7: shifter.SchDoc]

### Parts
D6  LED_SMD  [0603_LED]
D7  LED_SMD  [0603_LED]
D8  LED_SMD  [0603_LED]
D9  LED_SMD  [0603_LED]
R17  value 220 ohm  [RES_ERA2APB221X]  (hidden comment: ERA2APB221X)
R18  value 220 ohm  [RES_ERA2APB221X]  (hidden comment: ERA2APB221X)
R19  value 220 ohm  [RES_ERA2APB221X]  (hidden comment: ERA2APB221X)
R20  value 220 ohm  [RES_ERA2APB221X]  (hidden comment: ERA2APB221X)
U7  SN74HC595N  [DIP794W45P254L1969H508Q16]

### Ports
5V, DS/SER/DATA, GND, RCLK/ST_CP, SRCLK/SH_CP/CLOCK

### Nets
5v: U7.10(~{SRCLR}) U7.16(VCC) ; port 5V
GND_1: D6.2(K) D7.2(K) D8.2(K) D9.2(K) U7.8(GND) U7.13(~{OE}) ; port GND
NetD6_1: D6.1(A) R17.1
NetD7_1: D7.1(A) R18.1
NetD8_1: D8.1(A) R19.1
NetD9_1: D9.1(A) R20.1
NetJ5_26: U7.11(SRCLK) ; port SRCLK/SH_CP/CLOCK
NetJ5_27: U7.12(RCLK) ; port RCLK/ST_CP
NetJ5_28: U7.14(SER) ; port DS/SER/DATA
NetR17_2: R17.2 U7.4(QE)
NetR18_2: R18.2 U7.3(QD)
NetR19_2: R19.2 U7.2(QC)
NetR20_2: R20.2 U7.1(QB)

Not connected (* = marked no-connect by the designer): U7 5(QF)* 6(QG)* 7(QH)* 9(QH')* 15(QA)*

### Notes on the sheet
- panneau de contrôle d'acces
- EasyTEK
- Drira Habib

### Library data of the parts
D6-D9 = LED_SMD: as D1 on sheet max485; PackageReference: 0603 (1608 Metric); PackageDescription: 1.60mm L x 0.80mm W; Digikey Part Number: 160-1447-1-ND; Value: RED
R17-R20 = ERA2APB221X: Availability: Unavailable; MP: ERA2APB221X; Price: None; Package: None
U7 = SN74HC595N: Package: None; Price: None; Availability: Unavailable; MP: SN74HC595N; Value: *

## Nets that join several sheets
5v: panneau_sheet (J5.30), regulateur de tension (C3.1 C4.1 IC1.3), pcf (U1.8), relay (R9.2 R11.2 R13.2 R15.2), shifter (U7.10 U7.16)
+12: panneau_sheet (I1.1), lecteur_8 (8 pins), regulateur de tension (Diode_Schottky1.2 J1.1)
GND_1: panneau_sheet (7 pins), lecteur_8 (8 pins), regulateur de tension (6 pins), pcf (U1.1 U1.2 U1.3 U1.16), relay (Q1.E Q2.E Q3.E Q4.E), shifter (6 pins)
NetD2_1: pcf (U1.9), relay (D2.1)
NetD3_1: pcf (U1.10), relay (D3.1)
NetD4_1: pcf (U1.11), relay (D4.1)
NetD5_1: pcf (U1.12), relay (D5.1)
NetENC1_3: panneau_sheet (J5.10), enc28j60 (ENC1.3)
NetENC1_5: panneau_sheet (J5.9), enc28j60 (ENC1.5)
NetENC1_6: panneau_sheet (J5.15), enc28j60 (ENC1.6)
NetENC1_8: panneau_sheet (J5.8), enc28j60 (ENC1.8)
NetENC1_9: panneau_sheet (J5.2), enc28j60 (ENC1.9), max485 (U2.5)
NetENC1_10: panneau_sheet (J5.1), enc28j60 (ENC1.10), max485 (U2.8)
NetI1_3: panneau_sheet (I1.3 J5.11), pcf (U1.15)
NetI1_4: panneau_sheet (I1.4 J5.14), pcf (U1.14)
NetJ2_1: panneau_sheet (J2.1), pcf (U1.4)
NetJ3_1: panneau_sheet (J3.1), pcf (U1.5)
NetJ4_1: panneau_sheet (J4.1), pcf (U1.6)
NetJ5_3: panneau_sheet (J5.3), pcf (U1.13)
NetJ5_4: panneau_sheet (J5.4), max485 (R3.2 U2.2)
NetJ5_5: panneau_sheet (J5.5), max485 (R2.2 U2.3)
NetJ5_6: panneau_sheet (J5.6), max485 (R4.2 U2.1)
NetJ5_7: panneau_sheet (J5.7), max485 (R1.2 U2.4)
NetJ5_17: panneau_sheet (J5.17), lecteur_8 (P1.3 P2.3)
NetJ5_18: panneau_sheet (J5.18), lecteur_8 (P1.4 P2.4)
NetJ5_19: panneau_sheet (J5.19), lecteur_8 (P3.3 P4.3)
NetJ5_20: panneau_sheet (J5.20), lecteur_8 (P3.4 P4.4)
NetJ5_21: panneau_sheet (J5.21), lecteur_8 (P5.3 P6.3)
NetJ5_22: panneau_sheet (J5.22), lecteur_8 (P5.4 P6.4)
NetJ5_23: panneau_sheet (J5.23), lecteur_8 (P7.3 P8.3)
NetJ5_24: panneau_sheet (J5.24), lecteur_8 (P7.4 P8.4)
NetJ5_26: panneau_sheet (J5.26), shifter (U7.11)
NetJ5_27: panneau_sheet (J5.27), shifter (U7.12)
NetJ5_28: panneau_sheet (J5.28), shifter (U7.14)
NetJ6_1: panneau_sheet (J6.1), pcf (U1.7)